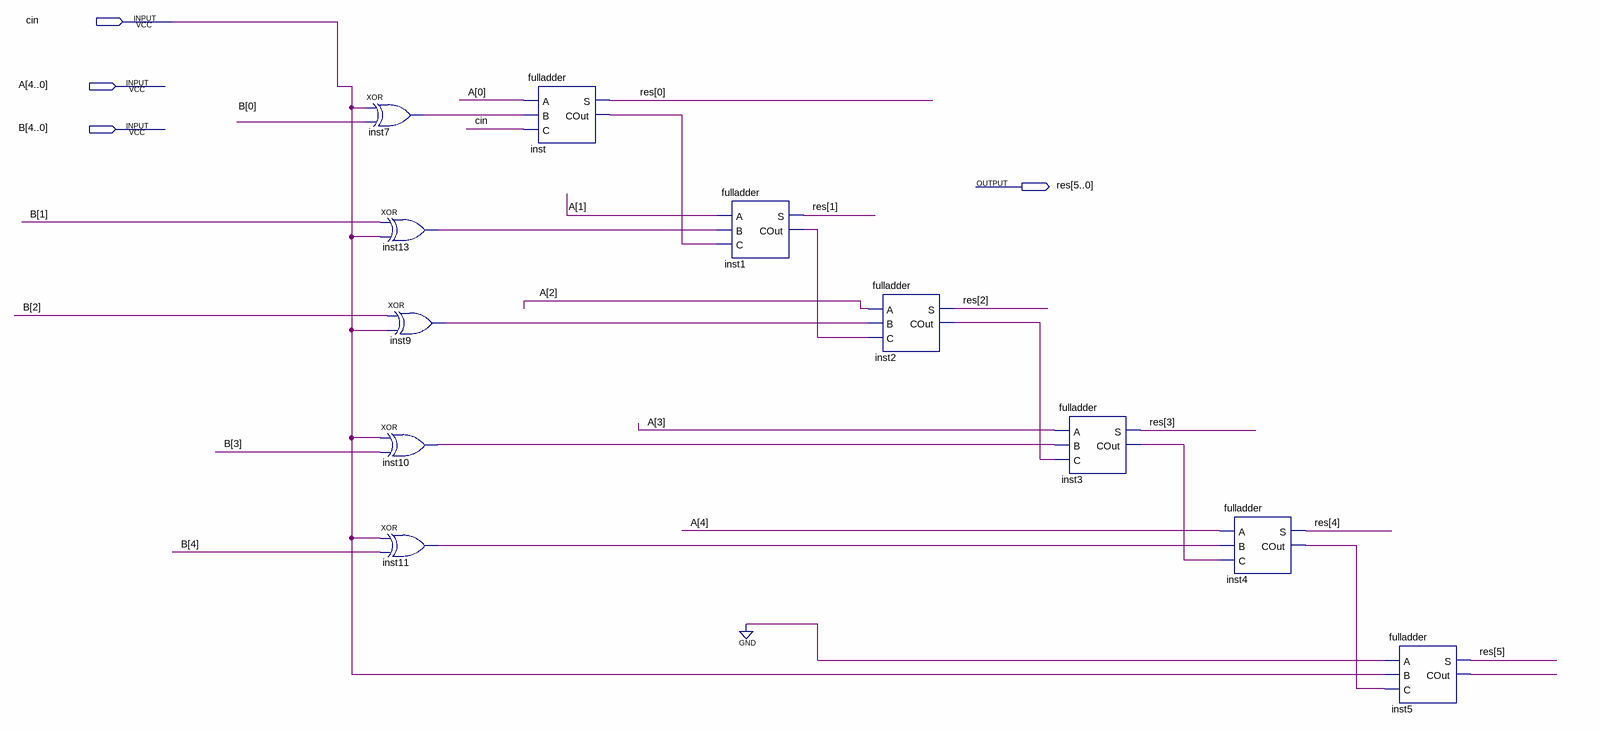
[diagram p0: schematic sheet]
// Quartus schematic 5bitFA.bdf as structural Verilog: 11 symbols, 4 pins
module \5bitFA  (
  input  cin,
  input  [4:0] A,
  input  [4:0] B,
  output [5:0] res
);

  wire inst1_cout, inst2_cout, inst3_cout, inst4_cout, inst5_cout, inst7_out, inst9_out, inst10_out,
       inst11_out, inst13_out, inst_cout;

  xor inst7 (inst7_out, cin, B[0]);
  xor inst13 (inst13_out, B[1], cin);
  xor inst9 (inst9_out, B[2], cin);
  xor inst10 (inst10_out, cin, B[3]);
  xor inst11 (inst11_out, cin, B[4]);
  fulladder inst (.A(A[0]), .B(inst7_out), .C(cin), .S(res[0]), .COut(inst_cout));
  fulladder inst1 (.A(A[1]), .B(inst13_out), .C(inst_cout), .S(res[1]), .COut(inst1_cout));
  fulladder inst2 (.A(A[2]), .B(inst9_out), .C(inst1_cout), .S(res[2]), .COut(inst2_cout));
  fulladder inst3 (.A(A[3]), .B(inst10_out), .C(inst2_cout), .S(res[3]), .COut(inst3_cout));
  fulladder inst4 (.A(A[4]), .B(inst11_out), .C(inst3_cout), .S(res[4]), .COut(inst4_cout));
  fulladder inst5 (.A(1'b0), .B(cin), .C(inst4_cout), .S(res[5]), .COut(inst5_cout));
endmodule
